# Altium schematic sheet SchematicV1.1.SchDoc
size 420 x 297 mm; SheetNumber: 1; SheetTotal: 1
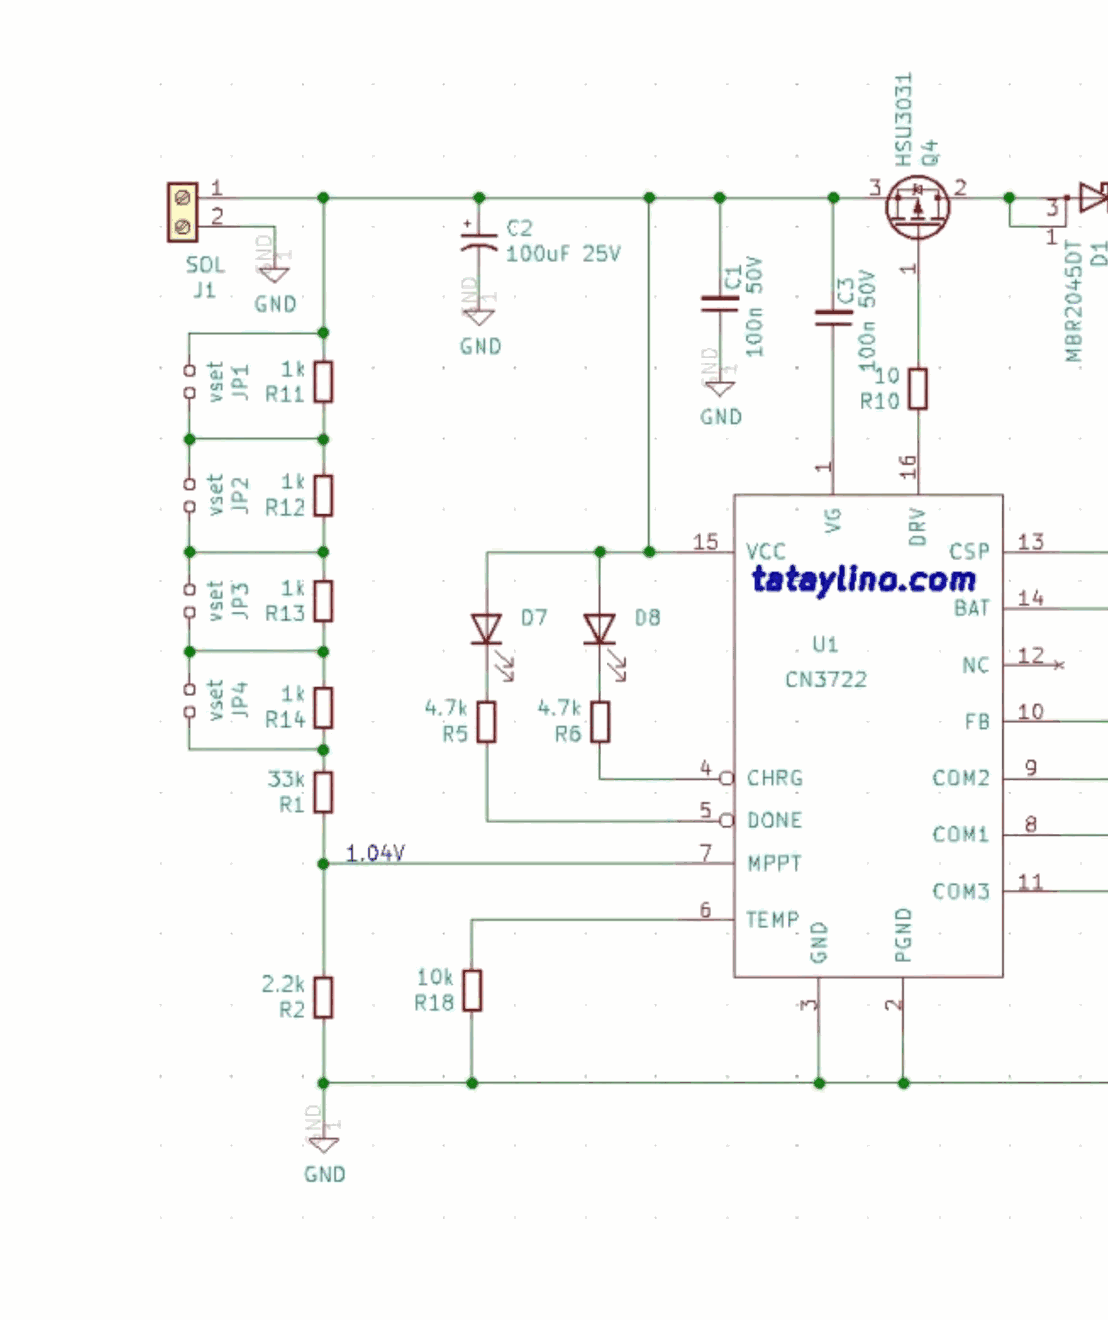
[diagram p0: SchematicV1.1.SchDoc, top left]
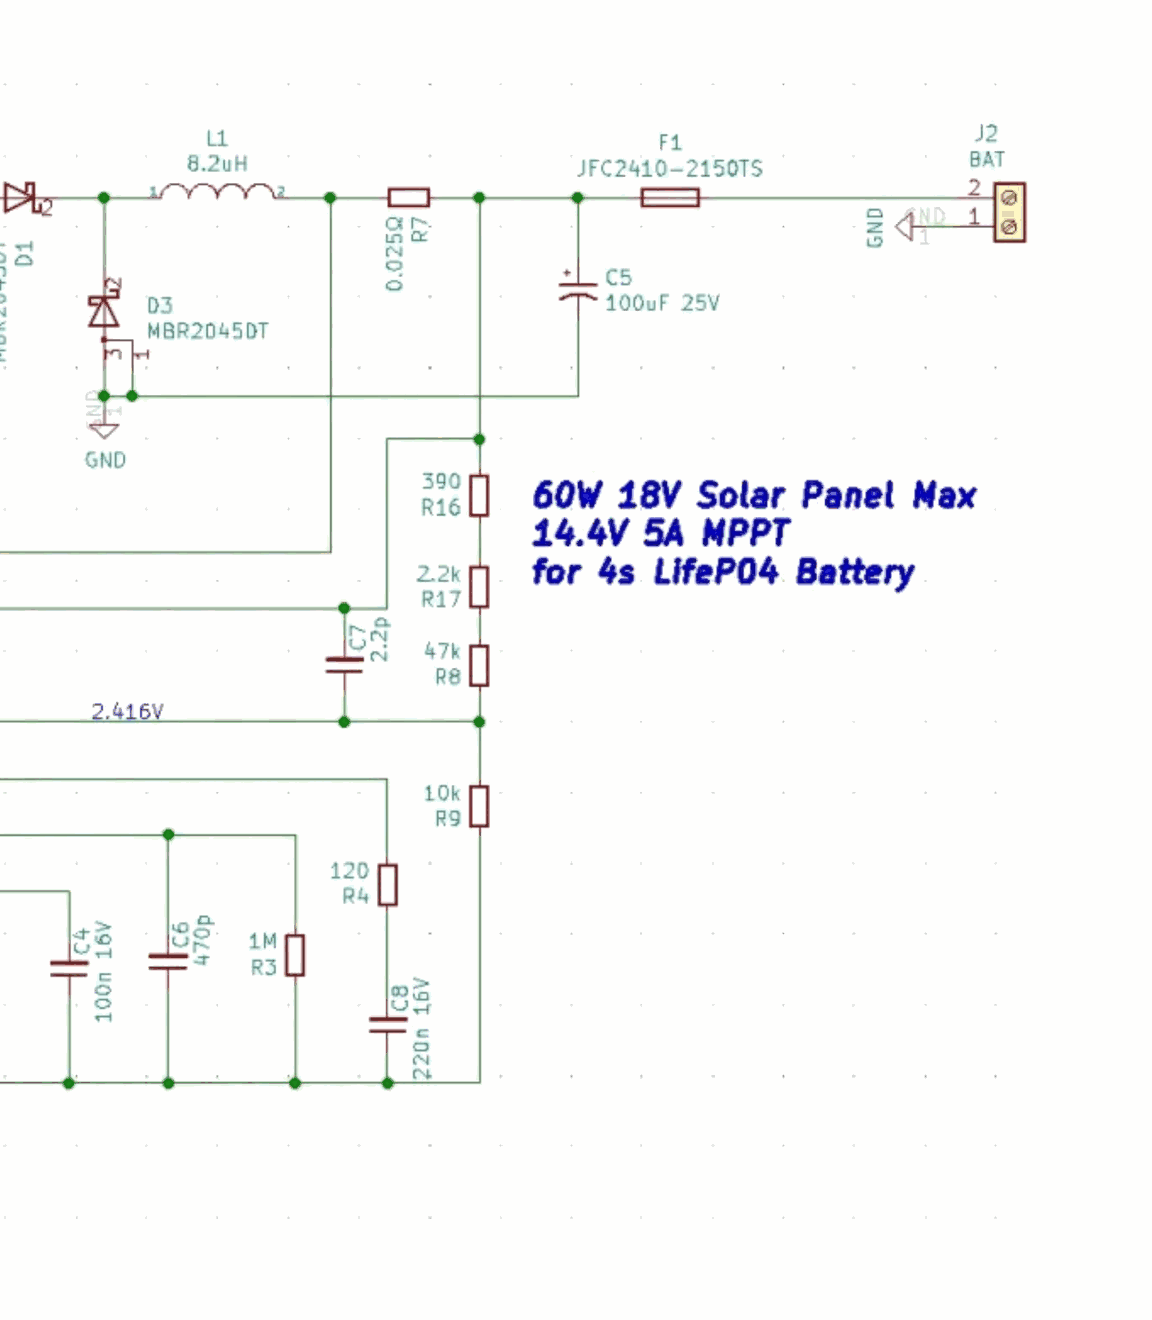
[diagram p1: SchematicV1.1.SchDoc, top right]
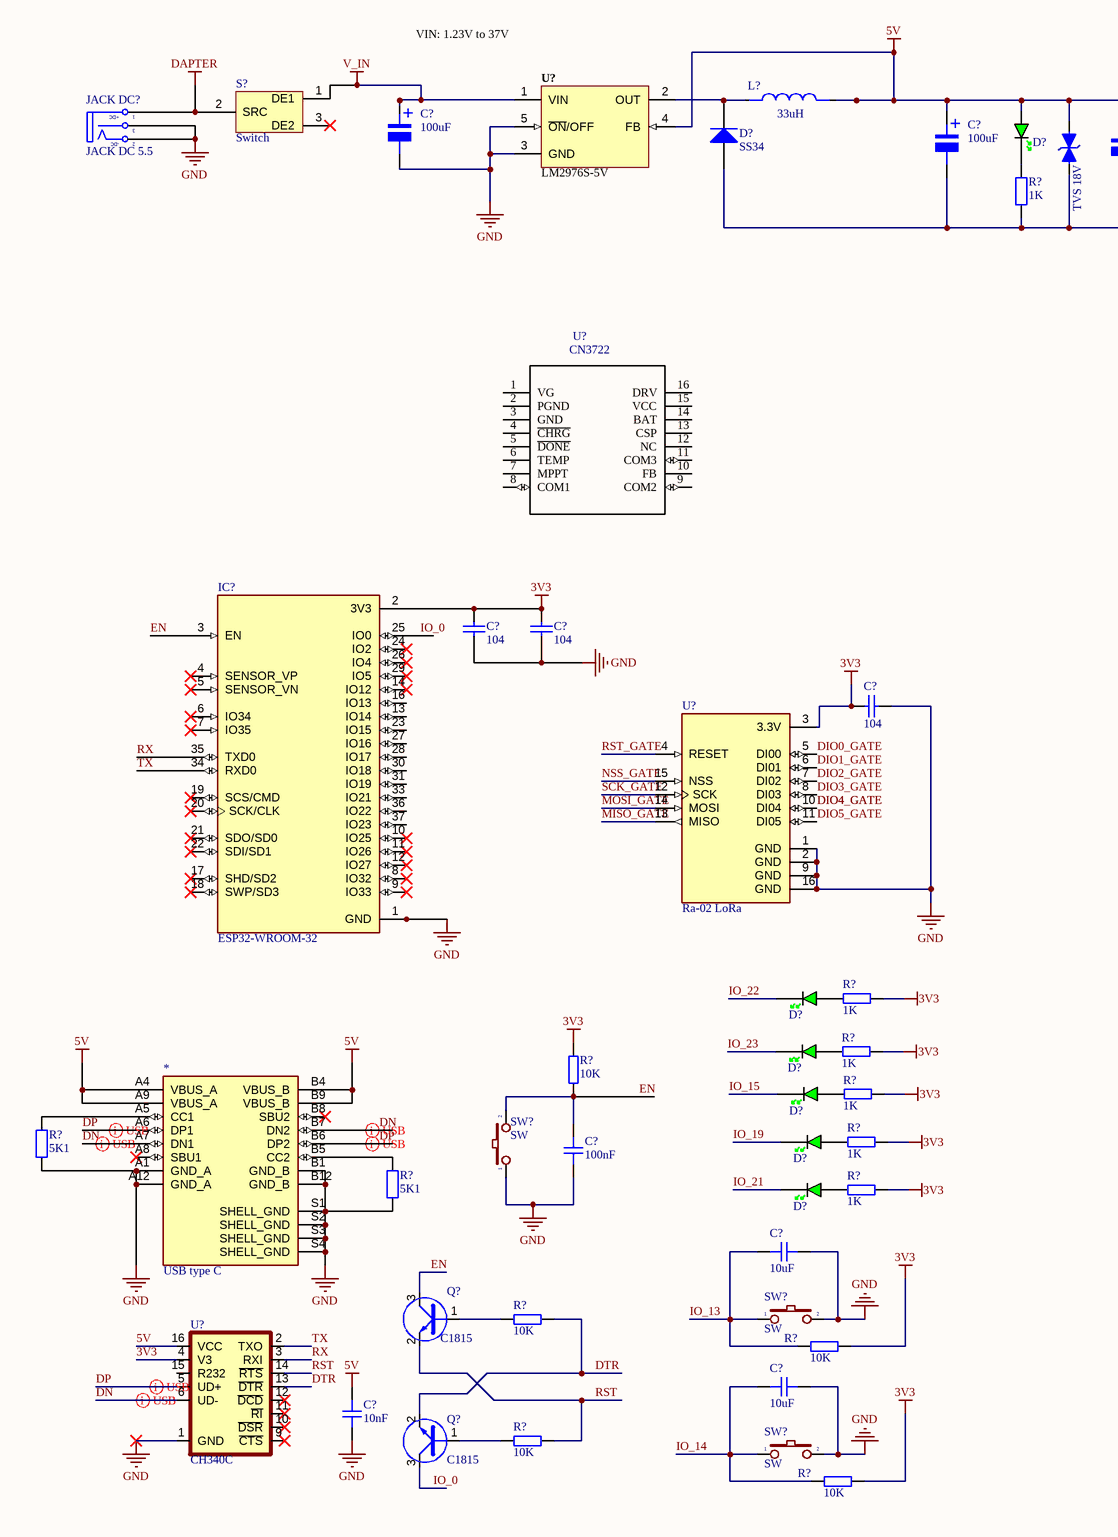
[diagram p2: SchematicV1.1.SchDoc, bottom left]
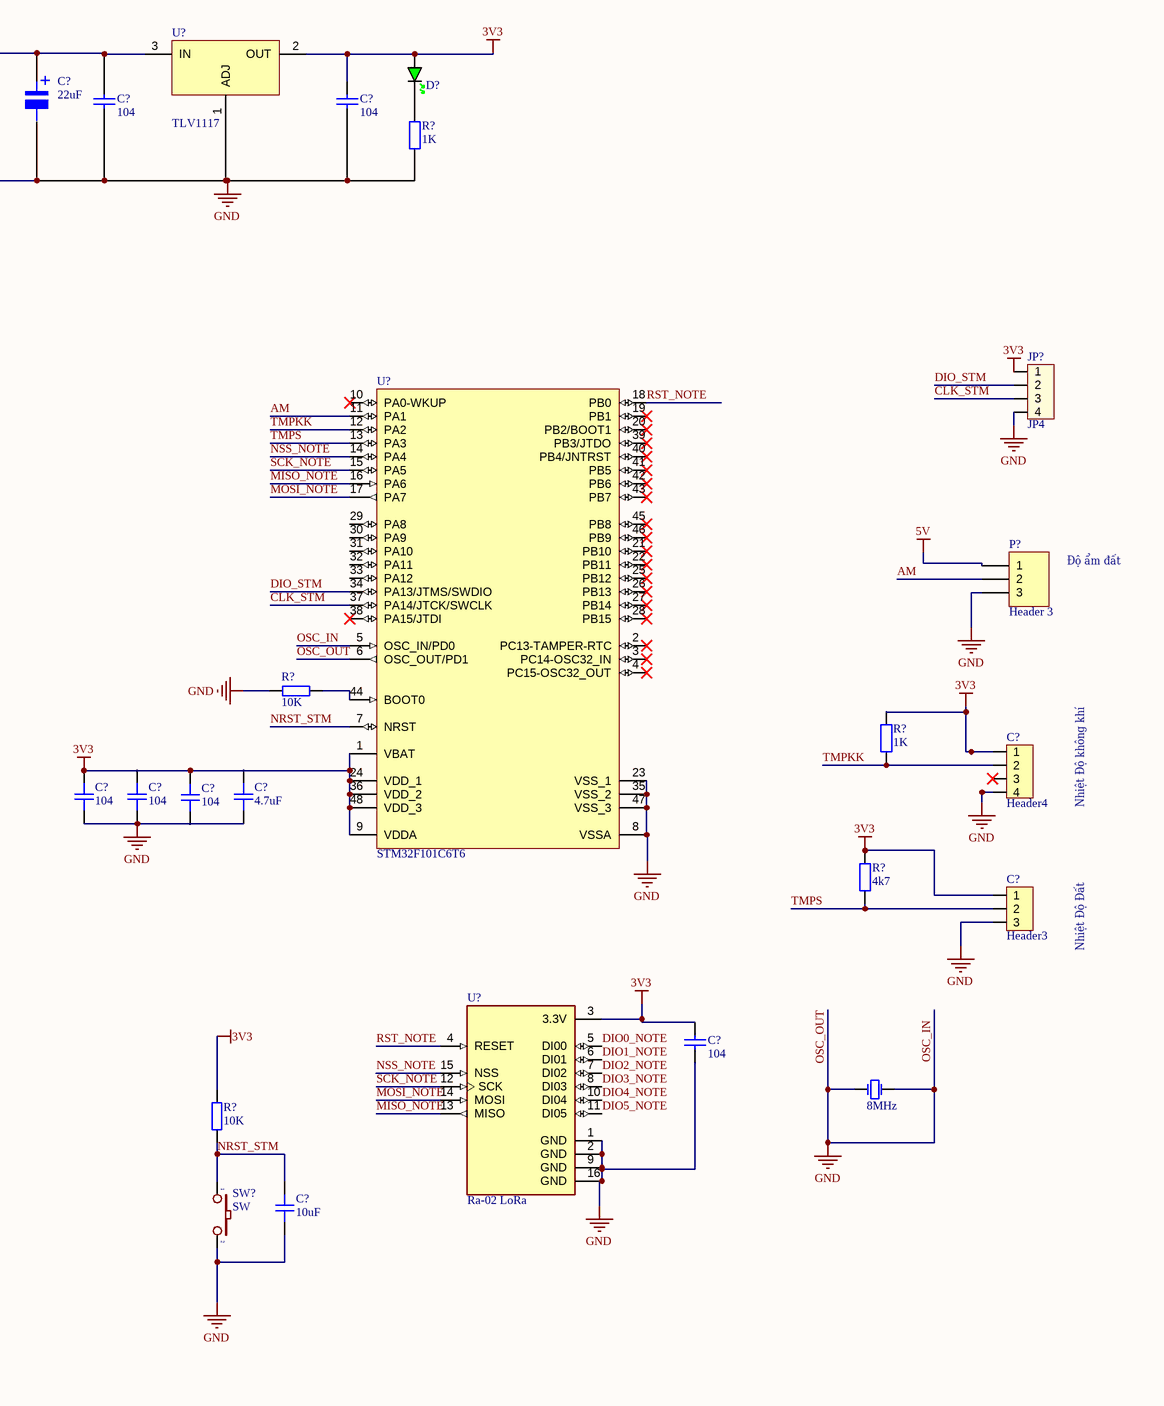
[diagram p3: SchematicV1.1.SchDoc, bottom right]

## Parts
(Parts that share a designator on the sheet are numbered #1, #2 ... from top to bottom, then left to right.)
*  USB type C  [USB type C]
C?#1  100uF  [tu nhom 6.3 (D)]
C?#2  100uF  [tu nhom 6.3 (D)]
C?#3  22uF  [tu nhom 6.3 (D)]
C?#4  104  [tu 0805]
C?#5  104  [tu 0805]
C?#6  104  [tu 0805]
C?#7  104  [tu 0805]
C?#8  104  [tu 0805]
C?#9  Header4  [HDR4]
C?#10  104  [CAP_0805]
C?#11  104  [CAP_0805]
C?#12  104  [CAP_0805]
C?#13  4.7uF  [CAP_0805]
C?#14  Header3  [HDR3]
C?#15  104  [tu 0805]
C?#16  100nF  [CAP_0805]
C?#17  10uF  [CAP_0805]
C?#18  10uF  [CAP_0805]
C?#19  10uF  [CAP_0805]
C?#20  10nF  [CAP_0805]
D?#1  GREEN  [LED_0805_GREEN]  (value not drawn)
D?#2  GREEN  [LED_0805_GREEN]  (value not drawn)
D?#3  SS34  [DIODE SMA]
D?#4  GREEN  [LED_0805_GREEN]  (value not drawn)
D?#5  GREEN  [LED_0805_GREEN]  (value not drawn)
D?#6  GREEN  [LED_0805_GREEN]  (value not drawn)
D?#7  GREEN  [LED_0805_GREEN]  (value not drawn)
D?#8  GREEN  [LED_0805_GREEN]  (value not drawn)
IC?  ESP32-WROOM-32  [MODULE_ESP32-WROOM-32]
JACK_DC?  JACK DC 5.5  [JACK DC 5.5]
JP?  JP4  [CON4]
L?  33uH  [IND_B82472P6472M000]
P?  Header 3  [HDR1X3]
Q?#1  C1815  [SOT23D]
Q?#2  C1815  [SOT23D]
R?#1  1K  [TRO SMD 0805]
R?#2  1K  [TRO SMD 0805]
R?#3  10K  [RES_0805]
R?#4  1K  [TRO SMD 0805]
R?#5  4k7  [TRO SMD 0805]
R?#6  1K  [RES_0805]
R?#7  1K  [RES_0805]
R?#8  10K  [RES_0805]
R?#9  1K  [RES_0805]
R?#10  5K1  [TRO SMD 0805]
R?#11  1K  [RES_0805]
R?#12  10K  [RES_0805]
R?#13  5K1  [TRO SMD 0805]
R?#14  1K  [RES_0805]
R?#15  10K  [RES_0805]
R?#16  10K  [RES_0805]
R?#17  10K  [RES_0805]
R?#18  10K  [RES_0805]
S?  Switch  [Switch]
SW?#1  SW  [SW2]
SW?#2  SW  [SW2]
SW?#3  SW  [SW2]
SW?#4  SW  [SW2]
TVS_18V  TVS  [CN4]  (value not drawn)
U?#1  LM2976S-5V  [TO263]
U?#2  TLV1117  [LM1117-SOP]
U?#3  CN3722  [*SOIC16_CN3722_CNA]
U?#4  STM32F101C6T6  [TQFP48]
U?#5  Ra-02 LoRa  [Ra-02]
U?#6  Ra-02 LoRa  [Ra-02]
U?#7  CH340C  [SOP-16]
Y?  8MHz  [XTAL]

## Nets
3V3: C?#5.1 C?#6.1 C?#7.1 C?#8.2 C?#9.1 C?#10.2 C?#12.2 C?#14.1 C?#15.1 D?#1.A IC?.2(3V3) JP?.1 R?#4.1 R?#5.1 R?#6.1 R?#7.1 R?#8.2 R?#9.1 R?#11.1 R?#12.2 R?#14.1 R?#16.2 R?#18.2 U?#2.2(OUT) U?#4.1(VBAT) U?#4.9(VDDA) U?#4.24(VDD_1) U?#4.36(VDD_2) U?#4.48(VDD_3) U?#5.3(3.3V) U?#6.3(3.3V) U?#7.4(V3)
5V: *.A4(VBUS_A) *.A9(VBUS_A) *.B4(VBUS_B) *.B9(VBUS_B) C?#2.1 C?#3.1 C?#4.1 C?#20.2 D?#2.A L?.2 P?.1 TVS_18V.1 U?#1.4(FB) U?#2.3(IN) U?#7.16(VCC)
DAPTER: JACK_DC?.1(T) S?.2(SRC)
OSC_IN: *.A1(GND_A) *.A12(GND_A) *.B1(GND_B) *.B12(GND_B) *.S1(SHELL_GND) *.S2(SHELL_GND) *.S3(SHELL_GND) *.S4(SHELL_GND) C?#1.2 C?#2.2 C?#3.2 C?#4.2 C?#5.2 C?#6.2 C?#7.2 C?#8.1 C?#9.4 C?#10.1 C?#11.1 C?#13.1 C?#14.3 C?#15.2 C?#16.1 C?#17.1 C?#18.1 C?#19.1 C?#20.1 D?#3.1(A) IC?.1(GND) IC?.15(GND) IC?.38(GND) IC?.39_1(GND) IC?.39_2(GND) IC?.39_3(GND) IC?.39_4(GND) IC?.39_5(GND) IC?.39_6(GND) IC?.39_7(GND) IC?.39_8(GND) IC?.39_9(GND) IC?.39_10(GND) IC?.39_11(GND) IC?.39_12(GND) IC?.39_13(GND) IC?.39_14(GND) IC?.39_15(GND) IC?.39_16(GND) IC?.39_17(GND) IC?.39_18(GND) IC?.39_19(GND) IC?.39_20(GND) IC?.39_21(GND) JACK_DC?.2(TN) JACK_DC?.3(S) JP?.4 P?.3 R?#1.2 R?#2.2 R?#3.1 R?#10.2 R?#13.2 SW?#1.1 SW?#2.2 SW?#3.2 SW?#4.2 TVS_18V.2 U?#1.3(GND) U?#1.5(~{ON}/OFF) U?#2.1(ADJ) U?#4.5(OSC_IN/PD0) U?#4.6(OSC_OUT/PD1) U?#4.8(VSSA) U?#4.23(VSS_1) U?#4.35(VSS_2) U?#4.47(VSS_3) U?#5.1(GND) U?#5.2(GND) U?#5.9(GND) U?#5.16(GND) U?#6.1(GND) U?#6.2(GND) U?#6.9(GND) U?#6.16(GND) U?#7.1(GND) Y?.1(OSC1) Y?.2(OSC2)  [also labelled GND, OSC_OUT]
V_IN: C?#1.1 S?.1(DE1) U?#1.1(VIN)
AM: P?.2 U?#4.11(PA1)
CLK_STM: JP?.3 U?#4.37(PA14/JTCK/SWCLK)
DIO0_GATE: U?#5.5(DI00)
DIO0_NOTE: U?#6.5(DI00)
DIO1_GATE: U?#5.6(DI01)
DIO1_NOTE: U?#6.6(DI01)
DIO2_GATE: U?#5.7(DI02)
DIO2_NOTE: U?#6.7(DI02)
DIO3_GATE: U?#5.8(DI03)
DIO3_NOTE: U?#6.8(DI03)
DIO4_GATE: U?#5.10(DI04)
DIO4_NOTE: U?#6.10(DI04)
DIO5_GATE: U?#5.11(DI05)
DIO5_NOTE: U?#6.11(DI05)
DIO_STM: JP?.2 U?#4.34(PA13/JTMS/SWDIO)
DN: *.A7(DN1) *.B7(DN2) U?#7.6(UD-)
DP: *.A6(DP1) *.B6(DP2) U?#7.5(UD+)
DTR: Q?#2.2(E) R?#15.2 U?#7.13(~{DTR})
EN: C?#16.2 IC?.3(EN) Q?#1.3(C) R?#8.1 SW?#1.2
IO_0: IC?.25(IO0) Q?#2.3(C)
IO_13: C?#17.2 R?#16.1 SW?#3.1
IO_14: C?#19.2 R?#18.1 SW?#4.1
IO_15: D?#6.K
IO_19: D?#7.K
IO_21: D?#8.K
IO_22: D?#4.K
IO_23: D?#5.K
MISO_GATE: U?#5.13(MISO)
MISO_NOTE: U?#4.16(PA6) U?#6.13(MISO)
MOSI_GATE: U?#5.14(MOSI)
MOSI_NOTE: U?#4.17(PA7) U?#6.14(MOSI)
NRST_STM: C?#18.2 R?#12.1 SW?#2.1 U?#4.7(NRST)
NSS_GATE: U?#5.15(NSS)
NSS_NOTE: U?#4.14(PA4) U?#6.15(NSS)
RST: Q?#1.2(E) R?#17.2 U?#7.14(~{RTS})
RST_GATE: U?#5.4(RESET)
RST_NOTE: U?#4.18(PB0) U?#6.4(RESET)
RX: IC?.35(TXD0) U?#7.3(RXI)
SCK_GATE: U?#5.12(SCK)
SCK_NOTE: U?#4.15(PA5) U?#6.12(SCK)
TMPKK: C?#9.2 R?#4.2 U?#4.12(PA2)
TMPS: C?#14.2 R?#5.2 U?#4.13(PA3)
TX: IC?.34(RXD0) U?#7.2(TXO)
Net*_A5: *.A5(CC1) R?#10.1
Net*_B5: *.B5(CC2) R?#13.1
NetD?#1_K: D?#1.K R?#1.1
NetD?#2_K: D?#2.K R?#2.1
NetD?#3_2: D?#3.2(K) L?.1 U?#1.2(OUT)
NetD?#4_A: D?#4.A R?#6.2
NetD?#5_A: D?#5.A R?#7.2
NetD?#6_A: D?#6.A R?#9.2
NetD?#7_A: D?#7.A R?#11.2
NetD?#8_A: D?#8.A R?#14.2
NetQ?#1_1: Q?#1.1(B) R?#15.1
NetQ?#2_1: Q?#2.1(B) R?#17.1
NetR?#3_2: R?#3.2 U?#4.44(BOOT0)

Not connected (* = marked no-connect by the designer): * A8(SBU1)* B8(SBU2)*; C?#9 3*; C?#11 2; C?#12 1; C?#13 2; IC? 4(SENSOR_VP)* 5(SENSOR_VN)* 6(IO34)* 7(IO35)* 8(IO32)* 9(IO33)* 10(IO25)* 11(IO26)* 12(IO27)* 13(IO14) 14(IO12)* 16(IO13) 17(SHD/SD2)* 18(SWP/SD3)* 19(SCS/CMD)* 20(SCK/CLK)* 21(SDO/SD0)* 22(SDI/SD1)* 23(IO15) 24(IO2)* 26(IO4)* 27(IO16) 28(IO17) 29(IO5)* 30(IO18) 31(IO19) 33(IO21) 36(IO22) 37(IO23); S? 3(DE2)* 4 5; U?#3 1(VG) 2(PGND) 3(GND) 4(~{CHRG}) 5(~{DONE}) 6(TEMP) 7(MPPT) 8(COM1) 9(COM2) 10(FB) 11(COM3) 12(NC) 13(CSP) 14(BAT) 15(VCC) 16(DRV); U?#4 2(PC13-TAMPER-RTC)* 3(PC14-OSC32_IN)* 4(PC15-OSC32_OUT)* 10(PA0-WKUP)* 19(PB1)* 20(PB2/BOOT1)* 21(PB10)* 22(PB11)* 25(PB12)* 26(PB13)* 27(PB14)* 28(PB15)* 29(PA8) 30(PA9) 31(PA10) 32(PA11) 33(PA12) 38(PA15/JTDI)* 39(PB3/JTDO)* 40(PB4/JNTRST)* 41(PB5)* 42(PB6)* 43(PB7)* 45(PB8)* 46(PB9)*; U?#7 9(~{CTS})* 10(~{DSR})* 11(~{RI})* 12(~{DCD})* 15(R232)

## Layout directives
differential pair: DN, DP

## Notes on the sheet
- VIN: 1.23V to 37V
- Độ ẩm đất
- Nhiệt Độ không khí
- Nhiệt Độ Đất
- THIS DOCUMENT AND THE DATA DISCLOSED HEREIN OR
- HEREWITH IS THE PROPERTY OF ALTIUM LIMITED AND MAY
- DWG NO:
- REVISION
- REV:
- DESCRIPTION
- DATE
- APPROVED
- BE FREELY DISTRIBUTED IN WHOLE. NO RIGHTS ARE
- RESERVED OR EXPRESS OR IMPLIED WARANTEE GIVEN.
- ENG:
- APPROVALS
- PROJECT
- DSN:
- CHK:
- REFERENCE DOCUMENTS
- PROJECT REVISION:
- TITLE
- DOCUMENT REVISION:
- DESIGN ITEM:
- BOM:
- FAB DWG:
- PCB DWG:
- ASSY DWG:
- SCALE:
- A3
- SIZE
- CAGE CODE
- FILE NAME
- DWG NO.
- SHEET
- OF
- REV
- (in symbol JACK DC 5.5) +DC; -DC
- (in symbol Tu Nhom 22uF 25V) +

## Library data of the parts
C?#1-C?#3 = Tu Nhom 22uF 25V: Dán; Don_Vi: Con; So_Chan: 2; Ten_Linh_Kien: Tụ Nhôm 22uF 25V; Ma_Hang: MH007613; Chung_Loai: Dán; Kieu_Chan: *
C?#4 C?#5 C?#8 C?#15 = Tu 0805 471 50V 10%: Dán; Don_Vi: Con; So_Chan: 2; Ten_Linh_Kien: Tụ 0805 471-470 10% 50V; Ma_Hang: MH004564; Chung_Loai: Dán; Kieu_Chan: *
C?#6 C?#7 = Tu 0805 680pF 50V 10%: Dán; Don_Vi: Con; So_Chan: 2; Ten_Linh_Kien: Tụ 0805 680pF 50V 10%; Ma_Hang: MH008098; Chung_Loai: Dán; Kieu_Chan: *
C?#9 = Header4: Header IDC, 4 x 1 Pin Vertical 2.54mm Pitch (Non-Boxed, Male); Manufacturer: W¨¹rth Elektronik eiSos GmbH; partNo: 613002143121; ComponentLink1 Description: Manufacturer; ComponentLink2 Description: Datasheet; NoPins: 02; Created Date: 29 March 2013; ComponentLink1URL: http://www.we-online.com; ComponentLink2URL: http://katalog.we-online.de/em/datasheet/6130xx143121.pdf; Created by: Karrer Zheng
C?#10-C?#13 C?#16-C?#20 = CAP_0805: Capacitor SMD 0805; Manufacturer: *; Manufacturer Part Number: *; Distributor Link: *; LCSC: *; Rating: *; Dielectric: *
C?#14 = Header3: Header IDC, 3 x 1 Pin Vertical 2.54mm Pitch (Non-Boxed, Male); Manufacturer: W¨¹rth Elektronik eiSos GmbH; partNo: 613002143121; ComponentLink1 Description: Manufacturer; ComponentLink2 Description: Datasheet; NoPins: 02; Created Date: 29 March 2013; ComponentLink1URL: http://www.we-online.com; ComponentLink2URL: http://katalog.we-online.de/em/datasheet/6130xx143121.pdf; Created by: Karrer Zheng
D?#1 D?#2 D?#4-D?#8 = LED_0805_GREEN: LED 0805 GREEN SMD; Manufacturer: *; Manufacturer Part Number: *; Distributor Link: *; LCSC: *
D?#3 = Diode SS34 ( 1N5822 ): Dán; Don_Vi: Con; Ma_Hang: MH002104; Ten_Linh_Kien: Diode SS34 3A 40V SMA ( 1N5822 SS34A); Kieu_Chan: *; Chung_Loai: Dán
IC? = ESP32-WROOM-32: Bluetooth, WiFi Transceiver Module 2.4GHz ~ 2.5GHz Surface Mount; MF: Espressif Systems; Package: Module Espressif Systems; Digi-Key_Part_Number: 1904-1010-1-ND; Digi-Key_Purchase_URL: https://www.digikey.com/product-detail/en/espressif-systems/ESP32-WROOM-32/1904-1010-1-ND/8544305?utm_source=snapeda&utm_medium=aggregator&utm_campaign=symbol; Value: *; MP: ESP32-WROOM-32; SnapEDA_Link: https://www.snapeda.com/parts/ESP32-WROOM-32/Espressif%20Systems/view-part/2753322/?ref=snap
JACK_DC? = JACK DC 5.5: Value: Jac DC
JP? = Con4: Connector 4; Value: Connector 4
L? = B82472P6472M000: MF: TDK; Price: None; Value: *; MP: B82472P6472M000; Package: None; Purchase-URL: https://pricing.snapeda.com/search/part/B82472P6472M000/?ref=eda; SnapEDA_Link: https://www.snapeda.com/parts/B82472P6472M000/TDK/view-part/?ref=snap; Check_prices: https://www.snapeda.com/parts/B82472P6472M000/TDK/view-part/?ref=eda; Availability: In Stock
P? = Header 3: Header, 3-Pin; LatestRevisionDate: 17-Jul-2002; LatestRevisionNote: Re-released for DXP Platform.; Publisher: Altium Limited
Q?#1 Q?#2 = 2SC1815: NPN 600mW, ECB; Value: C1815
R?#1 R?#2 R?#4 R?#5 R?#10 R?#13 = Tro 0805 5% 56k: Dán; Don_Vi: Con; So_Chan: 2; Ten_Linh_Kien: Trở 0805 5% 56k; Ma_Hang: MH005322; Chung_Loai: Dán; Kieu_Chan: *
R?#3 R?#6-R?#9 R?#11 R?#12 R?#14-R?#18 = RES_0805: Resistor SMD 0805; Manufacturer: *; Manufacturer Part Number: *; Distributor Link: *; LCSC: *
SW?#1-SW?#4 = SW2: Switch button 2 pin; Value: SW chip 2 pin
TVS_18V = TVS: Generic TVS Diode; Value: Zenner Protect AC input
U?#1 = LM2596: Max Input Voltage: 12 V; Max Output Current: 3 (6.0 peak) A; Max Output Voltage: mV; Category: IC-Power; Min Input Voltage: mV; Min Output Voltage: mV; Mounting Technology: Surface Mount; Status: Unreleased; Supply Voltage: mV; Temperature Range: -40 to +125 degC
U?#2 = LM1117-ADJ: 800mA Low-Dropout Linear Regulator; Creator: Nguyen Ba Bien; Website: http://group3i.net
U?#3 = CN3722: The CN3722(Note 1) is a PWM switch-mode battery charger controller that can be powered by photovoltaic cell. The...; MF: Consonance; SnapEDA_Link: https://www.snapeda.com/parts/CN3722/Consonance/view-part/?ref=snap; Package: None; MP: CN3722; Check_prices: https://www.snapeda.com/parts/CN3722/Consonance/view-part/?ref=eda; Value: *
U?#4 = STM32F101C6T6: STM32 ARM-based 32-bit MCU with 32 Kbytes Flash, 48-pin LQFP, Industrial Temperature; Published: 30-May-2008; DatasheetVersion: rev6, Mar-2008; PackageVersion: Mar-2008; PackageReference: LQFP48; Publisher: Altium Limited; PackageDescription: 48-Pin Low-Profile Quad Flat Pack, 7 x 7 mm Body, 0.5 mm Pitch (LQFP48); ComponentLink1Description: Manufacturer Link; ComponentLink1URL: www.st.com/stm32; ComponentLink2Description: Datasheet; ComponentLink2URL: http://www.st.com/stonline/products/literature/ds/13586.pdf
U?#5 U?#6 = Ra-02 LoRa: LoRa Module Ra-02
U?#7 = CH340C: https://linhkien.cxt.vn/4690-ch340c-ic-transceiver-2mbps-usb20-sop-16.html; MF: WCH; Package: Package; Check_prices: https://www.snapeda.com/parts/CH340C/WCH/view-part/5428851/?ref=eda; Value: *; Price: None; MP: CH340C; Availability: Unavailable; SnapEDA_Link: https://www.snapeda.com/parts/CH340C/WCH/view-part/5428851/?ref=snap
Y? = XTAL: Crystal Oscillator; Published: 8-Jun-2000; LatestRevisionDate: 17-Jul-2002; LatestRevisionNote: Re-released for DXP Platform.; PackageReference: R38; Publisher: Altium Limited